# EAGLE design svetlo_ocelac_druha_cast (EAGLE 5.11)
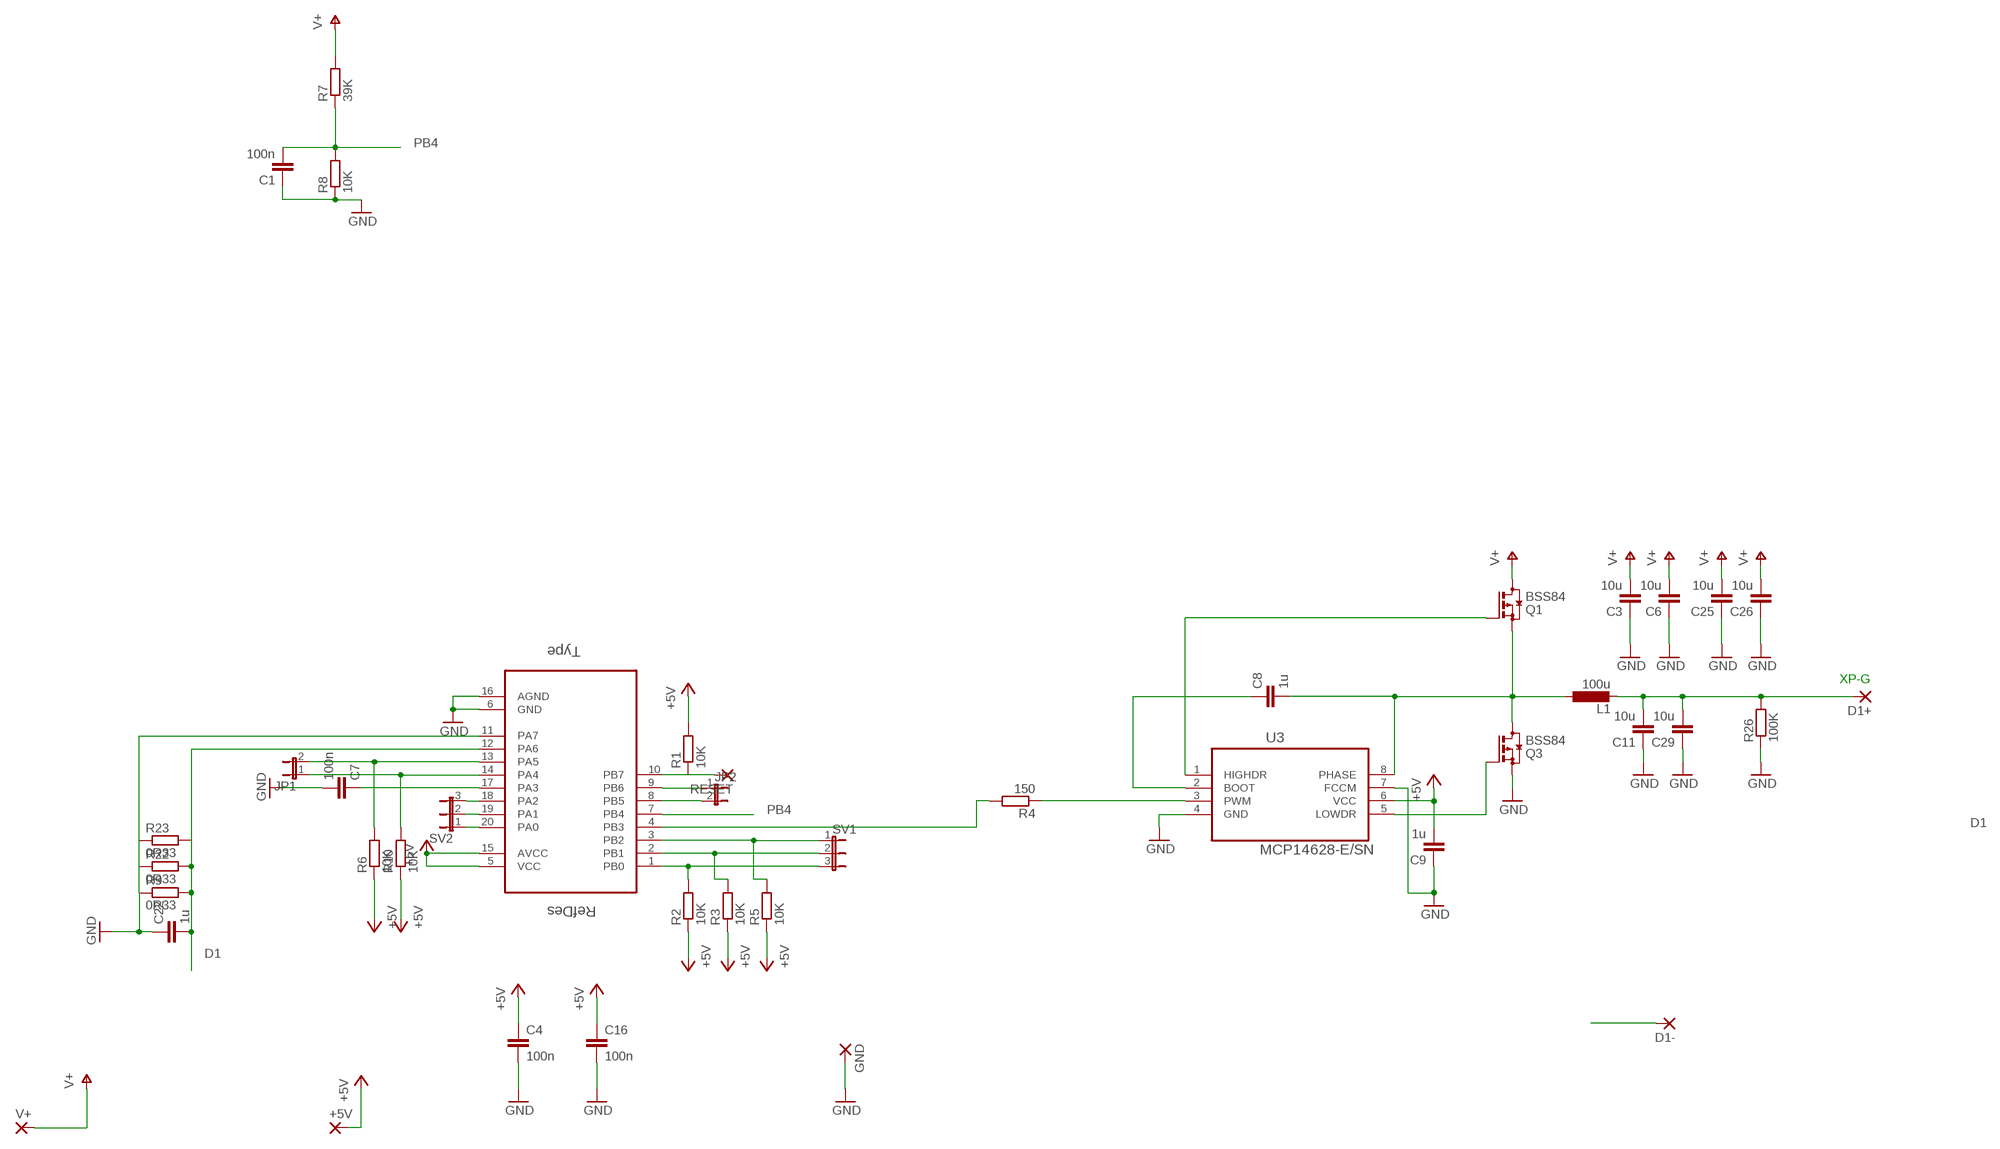
[diagram p0: schematic, sheet 1]

## Parts
+5V  2,54/0,9  [2,54/0,9]
C1  100n  C-EUC0805  [C0805]
C3  10u  C-EUC1206  [C1206]
C4  100n  C-EUC0805  [C0805]
C6  10u  C-EUC1206  [C1206]
C7  100n  C-EUC0805  [C0805]
C8  1u  C-EUC1206  [C1206]
C9  1u  C-EUC1206  [C1206]
C11  10u  C-EUC1206  [C1206]
C16  100n  C-EUC0805  [C0805]
C22  1u  C-EUC0805  [C0805]
C25  10u  C-EUC1206  [C1206]
C26  10u  C-EUC1206  [C1206]
C29  10u  C-EUC1206  [C1206]
D1+  3,81/1,4  [3,81/1,4]
D1-  3,81/1,4  [3,81/1,4]
GND  2,54/0,9  [2,54/0,9]
JP1  JP1E  [JP1]
JP2  JP1E  [JP1]
L1  100u  L-EU0204/5  [0204/5]
Q1  BSS84  [SOT23]
Q3  BSS84  [SOT23]
R1  10K  R-EU_R1206  [R1206]
R2  10K  R-EU_R0805  [R0805]
R3  10K  R-EU_R0805  [R0805]
R4  150  R-EU_R1206  [R1206]
R5  10K  R-EU_R0805  [R0805]
R6  10K  R-EU_R0805  [R0805]
R7  39K  R-EU_R0805  [R0805]
R8  10K  R-EU_R0805  [R0805]
R9  0R33  R-EU_R0805  [R0805]
R10  10K  R-EU_R0805  [R0805]
R22  0R33  R-EU_R0805  [R0805]
R23  0R33  R-EU_R0805  [R0805]
R26  100K  R-EU_R1206  [R1206]
RESET  2,54/0,9  [2,54/0,9]
SV1  JP2E  [JP2]
SV2  JP2E  [JP2]
U3  MCP14628-E/SN  [SOIC127P600X175-8N]
U4  ATTINY861A-SU  ATTINY861A-SUSOIC  [SOIC127P1032X265-20N]
V+  2,54/0,9  [2,54/0,9]

## Nets
+5V: +5V.1(P) C4.1 C9.2 C16.1 R1.2 R2.1 R3.1 R5.1 R6.1 R10.1 U3.6(VCC) U4.5(VCC) U4.15(AVCC)
D1: C22.2 D1-.1(P) R9.2 R22.2 R23.2 U4.12(PA6)
GND: C1.1 C3.1 C4.2 C6.1 C7.2 C9.1 C11.1 C16.2 C22.1 C25.1 C26.1 C29.1 GND.1(P) Q3.2(S) R8.1 R9.1 R22.1 R23.1 R26.1 U3.4(GND) U3.7(FCCM) U4.6(GND) U4.11(PA7) U4.16(AGND)
N$1: R1.1 RESET.1(P) U4.10(PB7)
N$2: JP1.1 R10.2 U4.14(PA4)
N$3: R4.1 U3.3(PWM)
N$4: Q3.1(G) U3.5(LOWDR)
N$5: C8.2 L1.1 Q1.2(S) Q3.3(D) U3.8(PHASE)
N$6: C11.2 C29.2 D1+.1(P) L1.2 R26.2
N$7: JP1.2 R6.2 U4.13(PA5)
N$8: SV2.3 U4.18(PA2)
N$9: R4.2 U4.4(PB3)
N$10: SV2.2 U4.19(PA1)
N$11: C7.1 U4.17(PA3)
N$12: SV2.1 U4.20(PA0)
N$13: JP2.1 U4.9(PB6)
N$14: JP2.2 U4.8(PB5)
N$19: R5.2 SV1.1 U4.3(PB2)
N$20: C8.1 U3.2(BOOT)
N$21: Q1.1(G) U3.1(HIGHDR)
N$22: R3.2 SV1.2 U4.2(PB1)
N$23: R2.2 SV1.3 U4.1(PB0)
PB4: C1.2 R7.1 R8.2 U4.7(PB4)
V+: C3.2 C6.2 C25.2 C26.2 Q1.3(D) R7.2 V+.1(P)

## Notes on the sheet
- XP-G

## Library data of the parts
+5V GND RESET V+ = wirepad:2,54/0,9: THROUGH-HOLE PAD
C1 C3 C4 C6-C9 C11 C16 C22 C25 C26 C29 = rcl:C-EU: CAPACITOR, European symbol
D1+ D1- = wirepad:3,81/1,4: THROUGH-HOLE PAD
JP1 JP2 = jumper:JP1E: JUMPER
L1 = rcl:L-EU: INDUCTOR, European symbol
Q1 Q3 = transistor-small-signal:BSS84: P-CHANNEL MOS FET
R1-R10 R22 R23 R26 = rcl:R-EU_: RESISTOR, European symbol
SV1 SV2 = jumper:JP2E: JUMPER
U3 = farnell:MCP14628-E/SN: MOSFET DRIVER, 2A, SYNC BUCK; MPN: MCP14628-E/SN; OC_FARNELL: 1629343; OC_NEWARK: 09P3985; PACKAGE: 8SOIC; SUPPLIER: Microchip
U4 = farnell:ATTINY861A-SU; DESCRIPTION: 8-bit Microcontroller with In-System Programmable Flash; MPN: ATTINY861A-SU; OC_FARNELL: 1841628; OC_NEWARK: 12T1344; PACKAGE: SOIC-20; SUPPLIER: Atmel

## Board
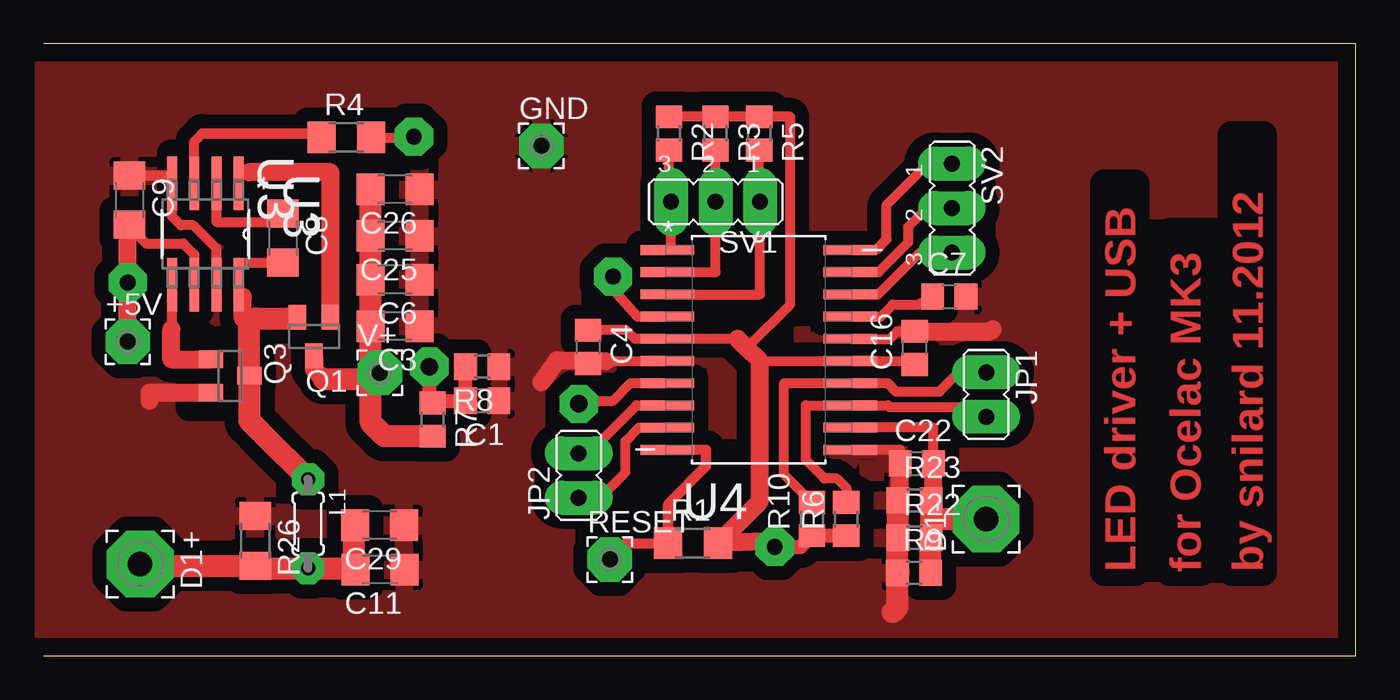
[diagram p1: board, top side]
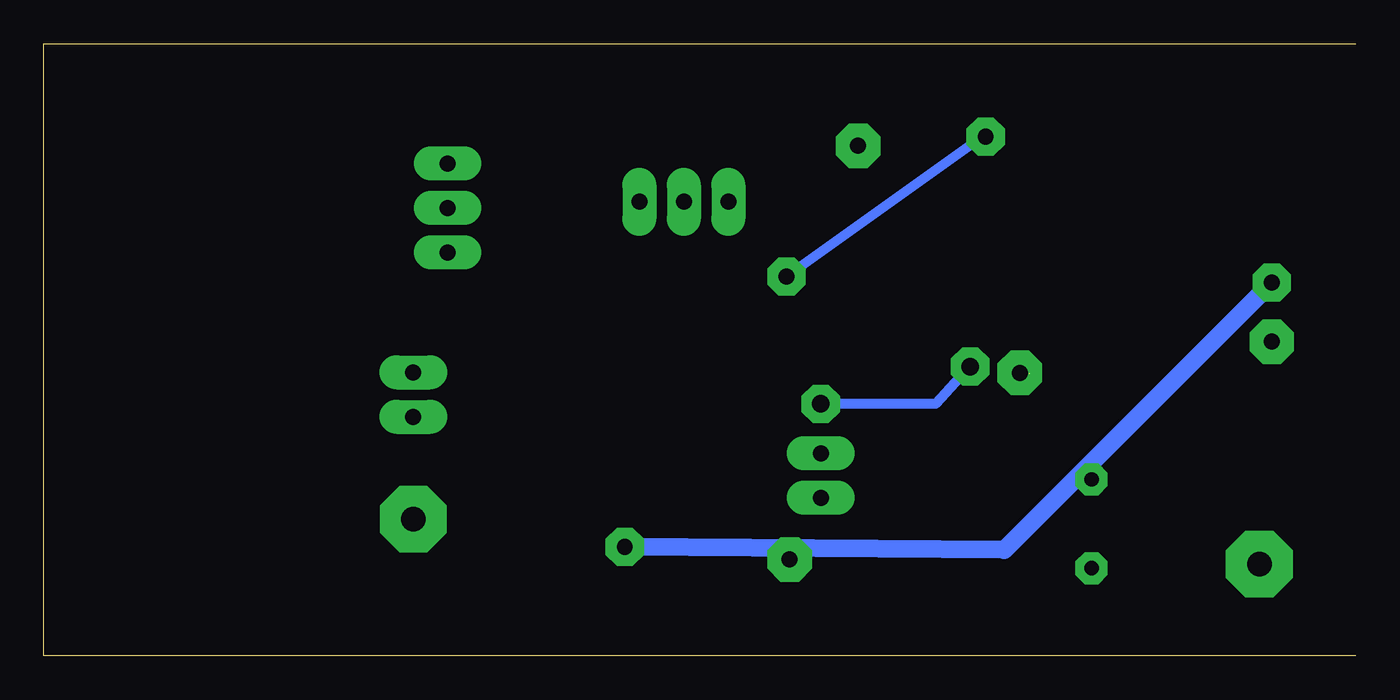
[diagram p2: board, bottom side, seen from below]

Size 75 x 35 mm. Coordinates in mm from the lower left corner, seen from the top.
Outline: 0,0 75,0 75,35 0,35
Copper layers (1*16): Top 0.035mm / dielectric 1.5mm / Bottom 0.035mm
Design rules "default *": minimum track width 10mil, minimum drill 24mil, track to track 12mil, track to pad 12mil, pad to pad 12mil, via to via 12mil, smd to smd 12mil, copper to edge 40mil, drill to drill 8mil, minimum pad ring 20mil, minimum via ring 20mil, stop-mask expansion 4mil, vias tented up to drill 0mil, thermal gap 10mil
tRestrict: area 7.3,23 to 8.7,28.7; area -6.8,13.5 to -3.9,17.1; area -8.4,13.7 to -5.3,17.8; area 8.4,14.2 to 11,15.8
bRestrict: area 16.5,49.8 to 17.8,50.5

### Footprints (pad centres in the part's own frame; a part is rotated, then mirrored left to right if it is on the bottom)
2,54/0,9 = drill 0.914 pad 2.54 octagon: 1 0,0
C0805 = smd 1.3 x 1.5: 1 -0.95,0; 2 0.95,0
C1206 = smd 1.6 x 1.8: 1 -1.4,0; 2 1.4,0
3,81/1,4 = drill 1.397 pad 3.81 octagon: 1 0,0
JP1 = drill 0.914 long: 1 0,-1.27; 2 0,1.27
0204/5 = drill 0.813 octagon: 1 -2.54,0; 2 2.54,0
SOT23 = smd 1 x 1.4: 1 -0.95,-1.1; 2 0.95,-1.1; 3 0,1.1
R1206 = smd 1.6 x 1.803: 1 -1.422,0; 2 1.422,0
R0805 = smd 1.3 x 1.5: 1 -0.95,0; 2 0.95,0
JP2 = drill 0.914 long: 1 -2.54,0; 2 0,0; 3 2.54,0
SOIC127P600X175-8N = smd 3.048 x 0.559: 1 -2.896,1.905; 2 -2.896,0.635; 3 -2.896,-0.635; 4 -2.896,-1.905; 5 2.896,-1.905; 6 2.896,-0.635; 7 2.896,0.635; 8 2.896,1.905
SOIC127P1032X265-20N = smd 3.048 x 0.559: 1 -5.232,5.715; 2 -5.232,4.445; 3 -5.232,3.175; 4 -5.232,1.905; 5 -5.232,0.635; 6 -5.232,-0.635; 7 -5.232,-1.905; 8 -5.232,-3.175; 9 -5.232,-4.445; 10 -5.232,-5.715; 11 5.232,-5.715; 12 5.232,-4.445; 13 5.232,-3.175; 14 5.232,-1.905; 15 5.232,-0.635; 16 5.232,0.635; 17 5.232,1.905; 18 5.232,3.175; 19 5.232,4.445; 20 5.232,5.715

### Placement (x,y rotation side)
+5V  4.8,17.96 0 top
C1  25.07,14.58 180 top
C3  20.09,18.85 180 top
C4  31.11,17.67 270 top
C6  20.09,21.51 180 top
C7  51.76,20.54 0 top
C8  13.68,23.89 270 top
C9  4.9,26.05 270 top
C11  19.22,4.93 180 top
C16  49.78,17.6 90 top
C22  49.9,10.99 0 top
C25  20.09,24 180 top
C26  20.09,26.67 180 top
C29  19.2,7.47 180 top
D1+  5.51,5.25 270 top
D1-  53.87,7.82 90 top
GND  28.45,29.16 0 top
JP1  53.87,14.94 180 top
JP2  30.58,10.31 0 top
L1  15.11,7.55 270 top
Q1  15.45,18.26 180 top
Q3  10.67,16 270 top
R1  37.11,6.44 0 top
R2  35.74,29.87 270 top
R3  38.4,29.87 270 top
R4  17.3,29.64 0 top
R5  40.89,29.87 270 top
R6  45.87,7.82 90 top
R7  22.23,13.51 270 top
R8  25.07,16.54 180 top
R9  49.75,4.75 0 top
R10  43.92,7.82 90 top
R22  49.78,6.76 0 top
R23  49.78,8.89 0 top
R26  12.09,6.58 270 top
RESET  32.36,5.51 0 top
SV1  38.4,25.96 180 top
SV2  51.92,25.6 270 top
U3  9.24,24.12 270 top
U4  40.87,17.49 0 top
V+  19.2,16.18 0 top

### Tracks (layer width: path | path; a pad name or v marks a point on that pad's centre or on a via)
+5V  (via drill 0.9 pad 2.18)
  Top 0.254: 5.19,24.24 5.08,24.13 C9.2 | C16.1 49.76,16.94
  Top 0.559: U3.6 8.61,22.96 7.99,23.58 5.85,23.58 5.19,24.24 4.81,24.63 | C4.1 33.3,18.62 33.79,18.13 U4.5 39.66,18.13 | C16.1 49.58,16.86 U4.15 40.93,16.86 | R2.1 R3.1 R5.1 42.67,30.82 42.67,20.09 40.18,17.6
  Top 0.813: v41.78,6.22 43.27,6.22 R10.1 R6.1
  Top 1.016: 39.66,18.13 40.18,17.6 40.93,16.86 40.93,8.83 R1.2 41.2,6.53 v41.78,6.22 | C9.2 4.8,24.55 v4.8,21.34 +5V.1
  Bottom 1.016: v41.78,6.22 20.09,6.04 v4.8,21.34
D1
  Top 0.559: U4.12 50.85,13.05 C22.2
  Top 1.016: R23.2 50.85,8.89 C22.2
  Top 1.27: R9.2 50.7,6.72 R22.2 50.73,7.64 | 50.73,7.64 R23.2 | D1-.1 50.91,7.82 50.73,7.64
GND
  Top 0.559: 7.34,26.38 U3.4 7.34,25.12 7.83,24.63 8.54,24.63 9.88,23.29 U3.7 | C4.2 32.14,16.86 U4.6 | C16.2 48.78,18.55 48.35,18.13 U4.16 | U4.11 48.95,11.78 C22.1
  Top 0.61: C9.1 6.91,27.45 U3.4
  Top 1.016: 32.14,16.86 29.34,16.9 28.45,15.65 | C16.2 54.11,18.55 54.23,18.67 | R23.1 48.95,8.89 C22.1 | Q3.2 6.04,15.05 6.04,14.58
  Top 1.27: C11.1 20.6,4.94 | 48.54,2.49 48.8,2.75 R9.1 | R9.1 48.83,4.78 | R23.1 R22.1 48.8,6.72 R9.1 | R9.1 48.86,4.8
  pour Top (isolate 0.813): 0,35.03 99.92,35.03 99.92,0 0,0 0,34.85
N$1
  Top 0.559: 37.87,11.78 U4.10 | 35.69,8.4 35.69,8.66 35.74,8.71 | R1.1 33.28,6.44 RESET.1
  Top 0.61: 37.87,11.78 37.87,10.85 35.74,8.71 | R1.1 35.69,8.4
N$2
  Top 0.559: R10.2 42.32,10.37 42.32,15.59 U4.14 48.24,15.59 48.72,15.11 51.21,15.11 52.3,16.2 JP1.1
N$3
  Top 0.559: U3.3 8.61,29.41 9.07,29.87
  Top 0.61: 9.07,29.87 15.88,29.87 R4.1
N$4
  Top 0.559: U3.5 7.34,18.72 7.29,18.67
  Top 1.016: 7.29,18.67 7.29,16.95 Q3.1
N$5
  Top 0.559: 11.38,20.54 11.15,20.54 U3.8 11.15,22.49 C8.2
  Top 1.016: Q1.2 14.05,19.36 14.05,19.29 | 11.74,16.63 11.77,16.63 Q3.3 | 11.38,20.54 11.38,19.29 12.1,19.29
  Top 1.27: 14.05,19.29 12.1,19.29 11.74,19.29 11.74,16.63 | Q3.3 11.77,13.43 12.42,12.78 12.5,12.7 L1.1
N$6
  Top 1.016: L1.2 15.11,5.16
  Top 1.27: 17.73,5.01 L1.2 12.23,5.01 R26.2 6.67,5.16 | 17.73,5.01 C11.2 | 6.67,5.16 6.4,5.16 6.6,5.36 | D1+.1 6.67,5.16 | 17.73,5.01 17.73,7.4 C29.2
N$7
  Top 0.559: R6.2 45.87,9.6 45.34,10.13 44.63,10.13 43.56,11.2 43.56,14.32 U4.13 48.27,14.32 48.36,14.22 53.31,14.22 JP1.2
N$8
  Top 0.559: U4.18 47.69,20.67 50.09,23.06 SV2.3
N$9  (via drill 0.9 pad 2.18)
  Top 0.559: U4.4 33.94,19.4 32.54,20.98 v32.54,21.69 | v21.16,29.69 21.1,29.64 R4.2
  Bottom 0.559: v32.54,21.69 21.34,29.69 v21.16,29.69
N$10
  Top 0.559: U4.19 47.72,21.94 49.43,23.65 49.43,24.54 50.49,25.6 SV2.2
N$11
  Top 0.559: U4.17 47.84,19.4 48.54,20.09 50.01,20.09 C7.1
N$12
  Top 0.559: U4.20 47.56,23.21 48.18,23.82 48.18,25.78 50.32,27.91 51.69,27.91 SV2.1
N$13
  Top 0.559: U4.9 34.03,13.05 33.25,12.27 33.25,10.49 31.83,9.07 30.61,9.07 JP2.1
N$14
  Top 0.559: U4.8 33.87,14.32 31.65,12.09 31.09,12.09 JP2.2
N$19
  Top 0.559: U4.3 40.95,20.67 SV1.1 40.89,25.96 R5.2
N$20
  Top 0.559: U3.2 9.88,24.8 13.68,24.8 C8.1
  Top 0.61: 13.34,24.8 13.34,25.29 C8.1
N$21
  Top 0.559: U3.1 11.15,27.65 11.74,27.65
  Top 1.016: 11.74,27.65 16.4,27.65 Q1.1
N$22
  Top 0.559: U4.2 38.41,21.94 SV1.2 R3.2
N$23
  Top 0.559: U4.1 35.87,23.21 SV1.3 35.74,25.96 R2.2
PB4  (via drill 1 pad 2.18)
  Top 0.559: U4.7 33.54,15.59 32.54,14.58 30.76,14.58 v30.58,14.4
  Top 0.813: R8.2 C1.2 22.34,14.58 R7.1 22.05,14.64 v22.05,16.54
  Bottom 0.559: v30.58,14.4 24,14.4 v22.05,16.54
V+  (1 unrouted)
  Top 0.254: 18.69,16.51 19.05,16.51
  Top 0.813: 18.67,15.82 18.67,16.13
  Top 1.016: 16,15.82 15.45,16.38 Q1.3 | 18.69,16.18 V+.1
  Top 1.27: C26.2 C25.2 18.53,23.84 18.69,23.84 C6.2 | C6.2 18.53,21.67 | C6.2 C3.2 18.69,16.51 18.69,16.18 18.69,13.34 19.46,12.56 R7.2 | 16,15.82 18.67,15.82

### Text on the board
Top: LED driver + USB | for Ocelac MK3 | by snilard 11.2012